# Altium schematic sheet FPGA_SPI.SchDoc
size 393 x 281 mm; PageSetup: Record=PageOptions|CenterHorizontal=True|CenterVertical=True|PrintScale=0.94|XCorrection=0.00|YCorrection=0.00|PrintKind=0|BorderSize=5000000|LeftOffset=0|BottomOffset=0|Orientation=2|PaperLength=1000|PaperWidth=1000|Scale=100|PaperSource=15|PrintQuality=600|MediaType=1|DitherType=10|PrintScaleMode=1|PaperKind=A4; Adr1: August Barks gata 6B; Adr2: SE-421 32 Västra Frölunda; Adr3: Sweden; Webpage: www.omnisys.se
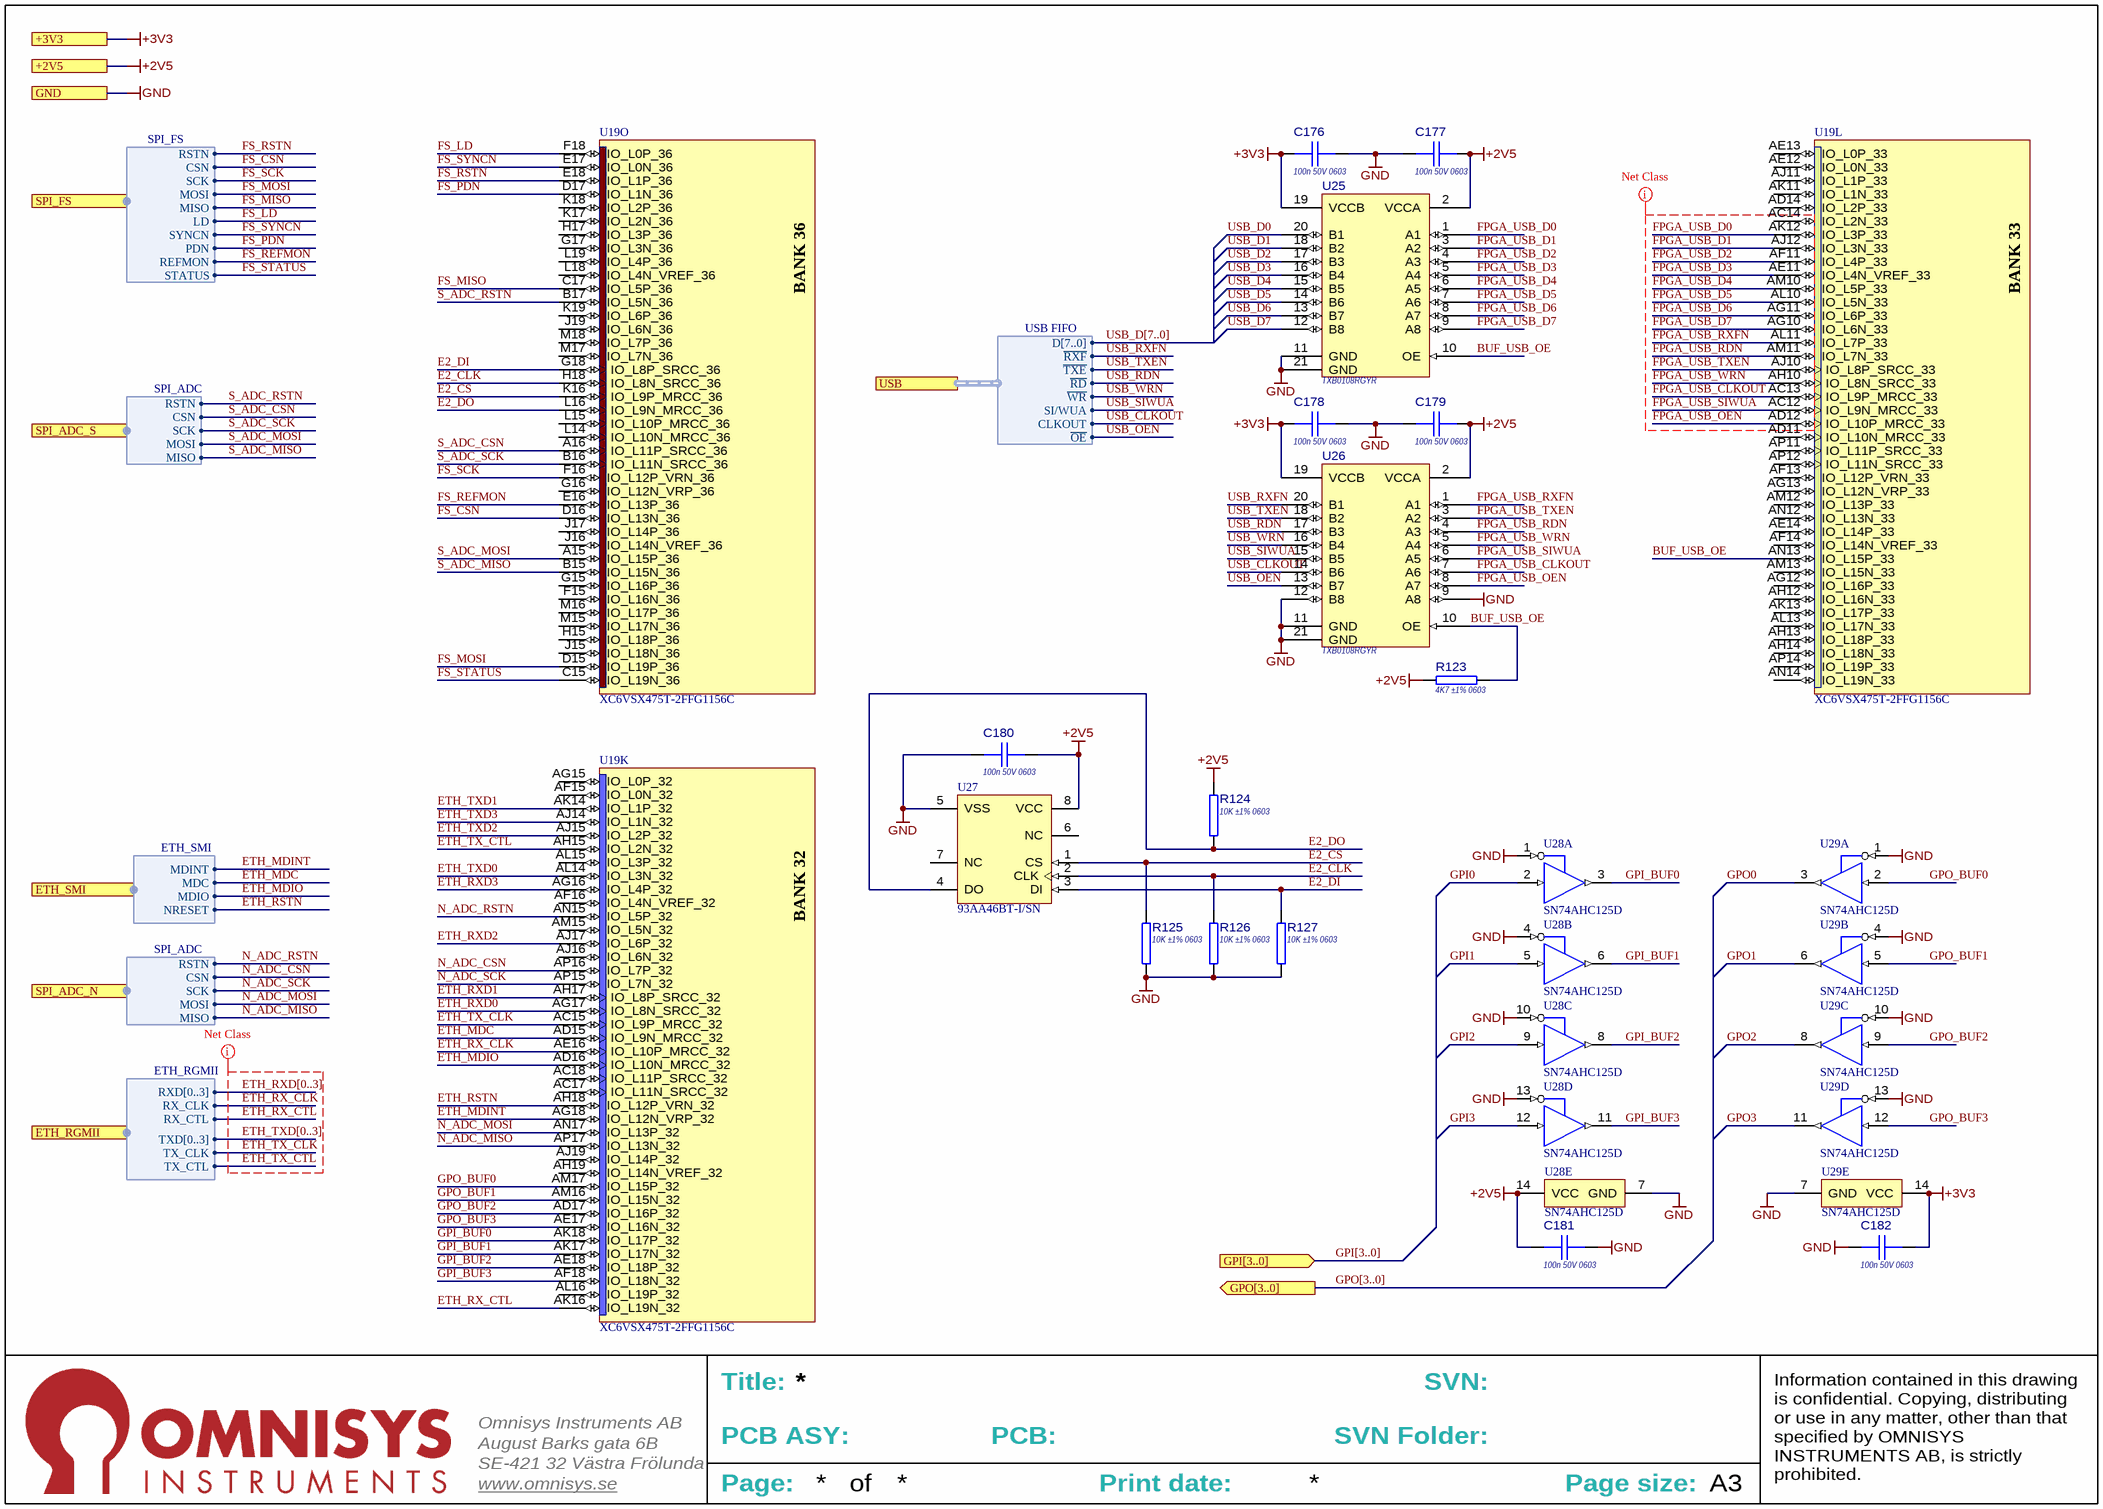
[diagram p0: FPGA_SPI.SchDoc]

## Parts
C176  100n 50V 0603  [CAPC1608X90N]
C177  100n 50V 0603  [CAPC1608X90N]
C178  100n 50V 0603  [CAPC1608X90N]
C179  100n 50V 0603  [CAPC1608X90N]
C180  100n 50V 0603  [CAPC1608X90N]
C181  100n 50V 0603  [CAPC1608X90N]
C182  100n 50V 0603  [CAPC1608X90N]
R123  4K7 ±1% 0603  [RESC1608N]
R124  10K ±1% 0603  [RESC1608N]
R125  10K ±1% 0603  [RESC1608N]
R126  10K ±1% 0603  [RESC1608N]
R127  10K ±1% 0603  [RESC1608N]
U19  XC6VSX475T-2FFG1156C  [FFG1156]  (parts K,L,O of 20)
U25  TXB0108RGYR  [TXB0108RGYR]
U26  TXB0108RGYR  [TXB0108RGYR]
U27  93AA46BT-I/SN  [SOIC-SN8_L]
U28  SN74AHC125D  [SOIC127P600X175-14N]  (parts A,B,C,D,E of 5)
U29  SN74AHC125D  [SOIC127P600X175-14L]  (parts A,B,C,D,E of 5)

## Ports
+2V5, +3V3, ETH_RGMII (harness ETH_RGMII), ETH_SMI (harness ETH_SMI), GND, GPI[3..0] (in), GPO[3..0] (out), SPI_ADC_N (harness SPI_ADC), SPI_ADC_S (harness SPI_ADC), SPI_FS (harness SPI_FS), USB (harness USB FIFO)

## Harnesses
USB FIFO: D[7..0], ~{RXF}, ~{TXE}, ~{RD}, ~{WR}, SI/WUA, CLKOUT, ~{OE}
SPI_ADC: RSTN, CSN, SCK, MOSI, MISO
SPI_FS: CSN, MOSI, SCK, MISO, RSTN, LD, SYNCN, PDN, REFMON, STATUS
ETH_RGMII: RXD[0..3], RX_CLK, RX_CTL, TXD[0..3], TX_CLK, TX_CTL
ETH_SMI: MDIO, MDC, MDINT, NRESET

## Nets
+2V5: C177.2 C179.2 C180.2 C181.1 R123.2 R124.2 U25.2(VCCA) U26.2(VCCA) U27.8(VCC) U28.14(VCC) ; port +2V5
+3V3: C176.1 C178.1 C182.1 U25.19(VCCB) U26.19(VCCB) U29.14(VCC) ; port +3V3
GND: C176.2 C177.1 C178.2 C179.1 C180.1 C181.2 C182.2 R125.1 R126.1 R127.1 U25.11(GND) U25.21(GND) U26.9(A8) U26.11(GND) U26.12(B8) U26.21(GND) U27.5(VSS) U28.1(1OE#) U28.4(2OE#) U28.7(GND) U28.10(3OE#) U28.13(4OE#) U29.1(1OE#) U29.4(2OE#) U29.7(GND) U29.10(3OE#) U29.13(4OE#) ; port GND
BUF_USB_OE: R123.1 U19.AN13(IO_L15P_33) U25.10(OE) U26.10(OE)
E2_CLK: R126.2 U19.H18(IO_L8N_SRCC_36) U27.2(CLK)
E2_CS: R125.2 U19.K16(IO_L9P_MRCC_36) U27.1(CS)
E2_DI: R127.2 U19.G18(IO_L8P_SRCC_36) U27.3(DI)
E2_DO: R124.1 U19.L16(IO_L9N_MRCC_36) U27.4(DO)
ETH_MDC: U19.AD15(IO_L9N_MRCC_32) ; port ETH_SMI.MDC
ETH_MDINT: U19.AG18(IO_L12N_VRP_32) ; port ETH_SMI.MDINT
ETH_MDIO: U19.AD16(IO_L10N_MRCC_32) ; port ETH_SMI.MDIO
ETH_RSTN: U19.AH18(IO_L12P_VRN_32) ; port ETH_SMI.NRESET
ETH_RX_CLK: U19.AE16(IO_L10P_MRCC_32) ; port ETH_RGMII.RX_CLK
ETH_RX_CTL: U19.AK16(IO_L19N_32) ; port ETH_RGMII.RX_CTL
ETH_RXD0: U19.AG17(IO_L8N_SRCC_32)
ETH_RXD1: U19.AH17(IO_L8P_SRCC_32)
ETH_RXD2: U19.AJ17(IO_L6P_32)
ETH_RXD3: U19.AG16(IO_L4P_32)
ETH_TX_CLK: U19.AC15(IO_L9P_MRCC_32) ; port ETH_RGMII.TX_CLK
ETH_TX_CTL: U19.AH15(IO_L2N_32) ; port ETH_RGMII.TX_CTL
ETH_TXD0: U19.AL14(IO_L3N_32)
ETH_TXD1: U19.AK14(IO_L1P_32)
ETH_TXD2: U19.AJ15(IO_L2P_32)
ETH_TXD3: U19.AJ14(IO_L1N_32)
FPGA_USB_CLKOUT: U19.AC13(IO_L9P_MRCC_33) U26.7(A6)
FPGA_USB_D0: U19.AK12(IO_L3P_33) U25.1(A1)
FPGA_USB_D1: U19.AJ12(IO_L3N_33) U25.3(A2)
FPGA_USB_D2: U19.AF11(IO_L4P_33) U25.4(A3)
FPGA_USB_D3: U19.AE11(IO_L4N_VREF_33) U25.5(A4)
FPGA_USB_D4: U19.AM10(IO_L5P_33) U25.6(A5)
FPGA_USB_D5: U19.AL10(IO_L5N_33) U25.7(A6)
FPGA_USB_D6: U19.AG11(IO_L6P_33) U25.8(A7)
FPGA_USB_D7: U19.AG10(IO_L6N_33) U25.9(A8)
FPGA_USB_OEN: U19.AD12(IO_L10P_MRCC_33) U26.8(A7)
FPGA_USB_RDN: U19.AM11(IO_L7N_33) U26.4(A3)
FPGA_USB_RXFN: U19.AL11(IO_L7P_33) U26.1(A1)
FPGA_USB_SIWUA: U19.AC12(IO_L9N_MRCC_33) U26.6(A5)
FPGA_USB_TXEN: U19.AJ10(IO_L8P_SRCC_33) U26.3(A2)
FPGA_USB_WRN: U19.AH10(IO_L8N_SRCC_33) U26.5(A4)
FS_CSN: U19.D16(IO_L13N_36) ; port SPI_FS.CSN
FS_LD: U19.F18(IO_L0P_36) ; port SPI_FS.LD
FS_MISO: U19.C17(IO_L5P_36) ; port SPI_FS.MISO
FS_MOSI: U19.D15(IO_L19P_36) ; port SPI_FS.MOSI
FS_PDN: U19.D17(IO_L1N_36) ; port SPI_FS.PDN
FS_REFMON: U19.E16(IO_L13P_36) ; port SPI_FS.REFMON
FS_RSTN: U19.E18(IO_L1P_36) ; port SPI_FS.RSTN
FS_SCK: U19.F16(IO_L12P_VRN_36) ; port SPI_FS.SCK
FS_STATUS: U19.C15(IO_L19N_36) ; port SPI_FS.STATUS
FS_SYNCN: U19.E17(IO_L0N_36) ; port SPI_FS.SYNCN
GPI0: U28.2(1A)
GPI1: U28.5(2A)
GPI2: U28.9(3A)
GPI3: U28.12(4A)
GPI_BUF0: U19.AK18(IO_L17P_32) U28.3(1Y)
GPI_BUF1: U19.AK17(IO_L17N_32) U28.6(2Y)
GPI_BUF2: U19.AE18(IO_L18P_32) U28.8(3Y)
GPI_BUF3: U19.AF18(IO_L18N_32) U28.11(4Y)
GPO0: U29.3(1Y)
GPO1: U29.6(2Y)
GPO2: U29.8(3Y)
GPO3: U29.11(4Y)
GPO_BUF0: U19.AM17(IO_L15P_32) U29.2(1A)
GPO_BUF1: U19.AM16(IO_L15N_32) U29.5(2A)
GPO_BUF2: U19.AD17(IO_L16P_32) U29.9(3A)
GPO_BUF3: U19.AE17(IO_L16N_32) U29.12(4A)
N_ADC_CSN: U19.AP16(IO_L7P_32) ; port SPI_ADC_N.CSN
N_ADC_MISO: U19.AP17(IO_L13N_32) ; port SPI_ADC_N.MISO
N_ADC_MOSI: U19.AN17(IO_L13P_32) ; port SPI_ADC_N.MOSI
N_ADC_RSTN: U19.AN15(IO_L5P_32) ; port SPI_ADC_N.RSTN
N_ADC_SCK: U19.AP15(IO_L7N_32) ; port SPI_ADC_N.SCK
S_ADC_CSN: U19.A16(IO_L11P_SRCC_36) ; port SPI_ADC_S.CSN
S_ADC_MISO: U19.B15(IO_L15N_36) ; port SPI_ADC_S.MISO
S_ADC_MOSI: U19.A15(IO_L15P_36) ; port SPI_ADC_S.MOSI
S_ADC_RSTN: U19.B17(IO_L5N_36) ; port SPI_ADC_S.RSTN
S_ADC_SCK: U19.B16(IO_L11N_SRCC_36) ; port SPI_ADC_S.SCK
USB_CLKOUT: U26.14(B6) ; port USB.CLKOUT
USB_D0: U25.20(B1)
USB_D1: U25.18(B2)
USB_D2: U25.17(B3)
USB_D3: U25.16(B4)
USB_D4: U25.15(B5)
USB_D5: U25.14(B6)
USB_D6: U25.13(B7)
USB_D7: U25.12(B8)
USB_OEN: U26.13(B7) ; port USB.~{OE}
USB_RDN: U26.17(B3) ; port USB.~{RD}
USB_RXFN: U26.20(B1) ; port USB.~{RXF}
USB_SIWUA: U26.15(B5) ; port USB.SI/WUA
USB_TXEN: U26.18(B2) ; port USB.~{TXE}
USB_WRN: U26.16(B4) ; port USB.~{WR}

Not connected (* = marked no-connect by the designer): U19 AC14(IO_L2N_33) AC17(IO_L11N_SRCC_32) AC18(IO_L11P_SRCC_32) AD11(IO_L10N_MRCC_33) AD14(IO_L2P_33) AE12(IO_L0N_33) AE13(IO_L0P_33) AE14(IO_L14P_33) AF13(IO_L12P_VRN_33) AF14(IO_L14N_VREF_33) AF15(IO_L0N_32) AF16(IO_L4N_VREF_32) AG12(IO_L16P_33) AG13(IO_L12N_VRP_33) AG15(IO_L0P_32) AH12(IO_L16N_33) AH13(IO_L18P_33) AH14(IO_L18N_33) AH19(IO_L14N_VREF_32) AJ11(IO_L1P_33) AJ16(IO_L6N_32) AJ19(IO_L14P_32) AK11(IO_L1N_33) AK13(IO_L17P_33) AL13(IO_L17N_33) AL15(IO_L3P_32) AL16(IO_L19P_32) AM12(IO_L13P_33) AM13(IO_L15N_33) AM15(IO_L5N_32) AN12(IO_L13N_33) AN14(IO_L19N_33) AP11(IO_L11P_SRCC_33) AP12(IO_L11N_SRCC_33) AP14(IO_L19P_33) F15(IO_L16N_36) G15(IO_L16P_36) G16(IO_L12N_VRP_36) G17(IO_L3N_36) H15(IO_L18P_36) H17(IO_L3P_36) J15(IO_L18N_36) J16(IO_L14N_VREF_36) J17(IO_L14P_36) J19(IO_L6N_36) K17(IO_L2N_36) K18(IO_L2P_36) K19(IO_L6P_36) L14(IO_L10N_MRCC_36) L15(IO_L10P_MRCC_36) L18(IO_L4N_VREF_36) L19(IO_L4P_36) M15(IO_L17N_36) M16(IO_L17P_36) M17(IO_L7N_36) M18(IO_L7P_36); U27 6(NC) 7(NC)

## Buses and harness runs
bus ETH_RXD[0..3]
bus ETH_TXD[0..3]
bus GPI[3..0] = port GPI[3..0]
bus GPO[3..0] = port GPO[3..0]
bus USB_D[7..0]

## Layout directives
net class Match_length_USB; rule Matched Net Lengths [Tolerance = 2mm]: FPGA_USB_CLKOUT, FPGA_USB_D0, FPGA_USB_D1, FPGA_USB_D2, FPGA_USB_D3, FPGA_USB_D4, FPGA_USB_D5, FPGA_USB_D6, FPGA_USB_D7, FPGA_USB_OEN, FPGA_USB_RDN, FPGA_USB_RXFN, FPGA_USB_SIWUA, FPGA_USB_TXEN, FPGA_USB_WRN
net class ETH_RGMII: ETH_RX_CLK, ETH_RX_CTL, ETH_RXD[0..3], ETH_TX_CLK, ETH_TX_CTL, ETH_TXD[0..3]

## Notes on the sheet
- Title:
- SVN:
- August Barks gata 6B
- SE-421 32 Västra Frölunda
- Omnisys Instruments AB
- PCB ASY:
- PCB:
- SVN Folder:
- www.omnisys.se
- Page:
- of
- Print date:
- Page size:
- A3
- Information contained in this drawing is confidential. Copying, distributing or use in any matter, other than that specified by OMNISYS INSTRUMENTS AB, is strictly prohibited.
- (in symbol CMP-0083-00172-1, part K) BANK 32
- (in symbol CMP-0083-00172-1, part L) BANK 33
- (in symbol CMP-0083-00172-1, part O) BANK 36

## Library data of the parts
C176-C182 = CMP-0300-002665-2: 100n 50V X7R ±10% 0603 (1608 metric); PartNumber: GRM188R71H104KA93; Rated voltage (V): 50; Capacitance (F): 100.0n; Package: 1608/0603; Temperature Charateristics: X7R; Thickness (mm): 0.90; Tolerance: ±10%
R123 = CMP-1800-002037-3: 4K7 ±1% ±100 ppm/˚C 0.10W 75V 0603 (1608 metric); Value: 4.7k; Power: 100mW; Case-EIA: 0603; Case-Metric: 1608; Temp. Coefficent: 0.01%; Maximum working voltage: 75V; Tolerance: 1%; Technology: SMT
R124-R127 = CMP-1800-002045-3: 10K ±1% ±100 ppm/˚C 0.10W 75V 0603 (1608 metric); Power: 100mW; Case-EIA: 0603; Case-Metric: 1608; Temp. Coefficent: 0.01%; Value: 10k; Maximum working voltage: 75V; Tolerance: 1%; Technology: SMT
U19 = CMP-0083-00172-1: Virtex-6 SXT Platform FPGA, 600 User I/Os, 20 GTXs, 1156-Ball FFBGA, Speed Grade 2, Commercial Grade, Pb-Free; Code_JEDEC: MS-034-AAR-1; PackageReference: FFG1156; Code_IPC: BGA100P34X34-1156; PackageDescription: 1156-Ball Flip-Chip Fine Pitch Ball Grid Array (FFG1156) - Pb-Free; PackageVersion: ver1.0, Jan-2010; DatasheetVersion: ver2.2, Jan-2010; PartId: 1
U25 U26 = CMP-2100-000560-1: TEXAS INSTRUMENTS   TXB0108RGYR   TRANSLATOR, VOLTAGE, 8BIT, 20VQFN; Nominal Supply Current: 10uA; Propagation Delay: 4ns; Max Supply Voltage: 5.5V; Min Supply Voltage: 1.2V; Output Current: 20uA; High Level Output Current: -20uA; Number of Channels: 8; Quiescent Current: 3.5uA; Rise Time: 0.8ns; Data Rate: 100Mbps; Turn-On Delay Time: 9.5ns; Contact Plating: Gold; Height: 0.8mm; Weight: 0.001517oz; Termination: SMD/SMT; Lead Free: Lead Free; Length: 4.5mm; Logic Function: Translator; Mount: Surface Mount; Package Quantity: 1; Number of Pins: 20; Min Operating Temperature: -40°C; PartNumber: TXB0108RGYR; Number of Inputs: 8; REACH SVHC: No SVHC; Low Level Output Current: 20uA; Case/Package: QFN; Number of Bits: 8; Packaging: Tape and Reel; Radiation Hardening: No; Max Operating Temperature: 85°C; Width: 3.5mm
U27 = CMP-0162-00270-1: 1K, 64x16-bit, 1.8V Microwire Serial EEPROM, 8-Pin SOIC 150mil, Industrial Temperature, Tape and Reel; Code_IPC: SOIC127P600-8; Code_JEDEC: MS-012; PackageVersion: revBB, Aug-2009; PackageReference: SOIC-SN8; PackageDescription: 8-Lead Plastic Small Outline (SN) - Narrow, 3.90mm Body [SOIC]; DatasheetVersion: revG, May-2008
U28 U29 = CMP-2100-000562-2: Buffer/Line Driver 4-CH Non-Inverting 3-ST CMOS 14-Pin SOIC Tube; Number of Bits: 4; Min Supply Voltage: 2V; Propagation Delay: 15ns; High Level Output Current: -8mA; Quiescent Current: 4uA; Number of Bits per Element: 1; Max Supply Voltage: 5.5V; Logic Function: Buffer,Inverting; Turn-On Delay Time: 11.5ns; Low Level Output Current: 8mA; REACH SVHC: No SVHC; Max Operating Temperature: 125°C; Polarity: Non-Inverting; Case/Package: SOIC; Number of Elements: 4; Package Quantity: 50; Number of Output Lines: 4; Min Operating Temperature: -40°C; Length: 8.65mm; Mount: Surface Mount; Number of Channels: 4; Number of Pins: 14; Termination: SMD/SMT; Number of Inputs: 4; Radiation Hardening: No; Lead Free: Lead Free; Height: 1.58mm; Number of Input Lines: 4; Packaging: Rail/Tube; Width: 3.91mm; Number of Outputs: 4; PartId: 1